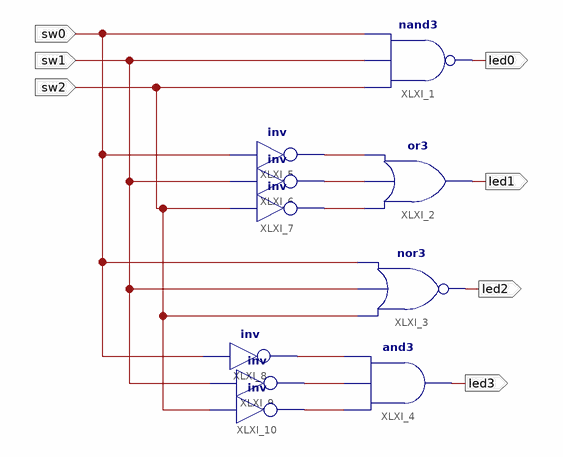
[diagram p0: schematic sheet 1]
// Xilinx ISE schematic tema3_2b.sch (spartan3e) as structural Verilog: 10 symbols, 7 ports
module tema3_2b (
  input  sw0,
  input  sw1,
  input  sw2,
  output led0,
  output led1,
  output led2,
  output led3
);

  wire XLXN_5, XLXN_6, XLXN_7, XLXN_9, XLXN_10, XLXN_11;

  nand XLXI_1 (led0, sw2, sw1, sw0);
  or XLXI_2 (led1, XLXN_11, XLXN_10, XLXN_9);
  nor XLXI_3 (led2, sw2, sw1, sw0);
  and XLXI_4 (led3, XLXN_7, XLXN_6, XLXN_5);
  not XLXI_5 (XLXN_9, sw0);
  not XLXI_6 (XLXN_10, sw1);
  not XLXI_7 (XLXN_11, sw2);
  not XLXI_8 (XLXN_5, sw0);
  not XLXI_9 (XLXN_6, sw1);
  not XLXI_10 (XLXN_7, sw2);
endmodule
